# EAGLE design makey_makey-v11 (EAGLE 6.1)

## Sheet 1 of 2
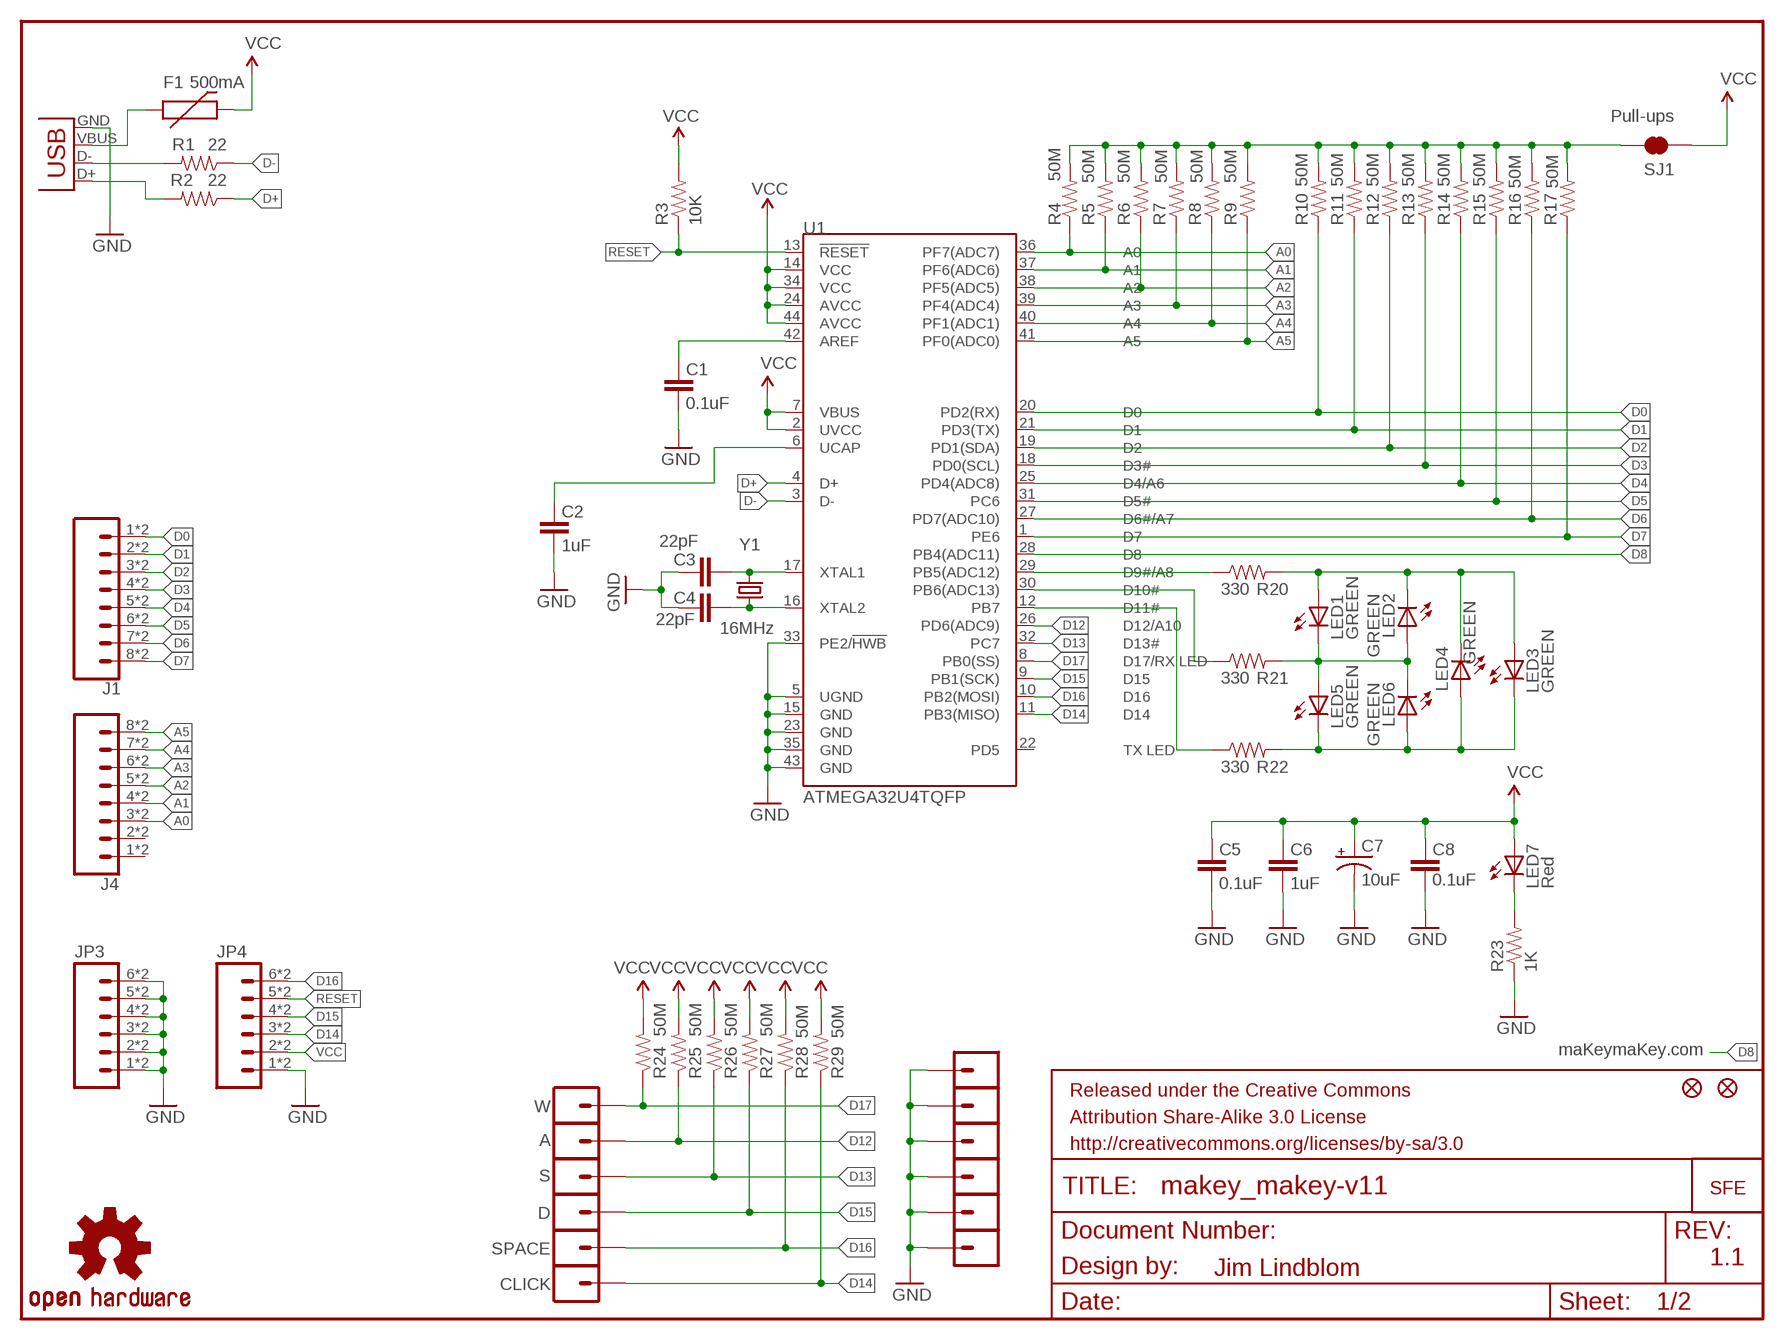
[diagram p0: schematic, sheet 1]

### Parts
A  M01ALLIGATOR-3MM  [1X01_ALLIGATOR_3MM]
C1  0.1uF  CAP0402-CAP  [0402-CAP]
C2  1uF  CAP0402-CAP  [0402-CAP]
C3  22pF  CAP0402-CAP  [0402-CAP]
C4  22pF  CAP0402-CAP  [0402-CAP]
C5  0.1uF  CAP0402-CAP  [0402-CAP]
C6  1uF  CAP0402-CAP  [0402-CAP]
C7  10uF  CAP_POL1206  [EIA3216]
C8  0.1uF  CAP0402-CAP  [0402-CAP]
CLICK  M01ALLIGATOR-3MM  [1X01_ALLIGATOR_3MM]
D  M01ALLIGATOR-3MM  [1X01_ALLIGATOR_3MM]
F1  500mA  PTCSMD  [PTC-1206]
J1  M08SMD-COMBO  [1X08_SMD_COMBINED]
J4  M08SMD-COMBO  [1X08_SMD_COMBINED]
JP1  FIDUCIALUFIDUCIAL  [MICRO-FIDUCIAL]
JP2  FIDUCIALUFIDUCIAL  [MICRO-FIDUCIAL]
JP3  M06SMD-STRAIGHT-COMBO  [1X06_SMD_STRAIGHT_COMBO]
JP4  M06SMD-STRAIGHT-COMBO  [1X06_SMD_STRAIGHT_COMBO]
JP5  M01ALLIGATOR-3MM  [1X01_ALLIGATOR_3MM]
JP6  M01ALLIGATOR-3MM  [1X01_ALLIGATOR_3MM]
JP7  M01ALLIGATOR-3MM  [1X01_ALLIGATOR_3MM]
JP8  M01ALLIGATOR-3MM  [1X01_ALLIGATOR_3MM]
JP9  LOGO-SFENEW  [SFE-NEW-WEBLOGO]
JP10  M01ALLIGATOR-3MM  [1X01_ALLIGATOR_3MM]
JP11  M01ALLIGATOR-3MM  [1X01_ALLIGATOR_3MM]
LED1  GREEN  LED1206-BOTTOM  [LED-1206-BOTTOM]
LED2  GREEN  LED1206-BOTTOM  [LED-1206-BOTTOM]
LED3  GREEN  LED1206-BOTTOM  [LED-1206-BOTTOM]
LED4  GREEN  LED1206-BOTTOM  [LED-1206-BOTTOM]
LED5  GREEN  LED1206-BOTTOM  [LED-1206-BOTTOM]
LED6  GREEN  LED1206-BOTTOM  [LED-1206-BOTTOM]
LED7  Red  LED0603  [LED-0603]
R1  22  RESISTOR0402-RES  [0402-RES]
R2  22  RESISTOR0402-RES  [0402-RES]
R3  10K  RESISTOR0402-RES  [0402-RES]
R4  50M  RESISTOR0402-RES  [0402-RES]
R5  50M  RESISTOR0402-RES  [0402-RES]
R6  50M  RESISTOR0402-RES  [0402-RES]
R7  50M  RESISTOR0402-RES  [0402-RES]
R8  50M  RESISTOR0402-RES  [0402-RES]
R9  50M  RESISTOR0402-RES  [0402-RES]
R10  50M  RESISTOR0402-RES  [0402-RES]
R11  50M  RESISTOR0402-RES  [0402-RES]
R12  50M  RESISTOR0402-RES  [0402-RES]
R13  50M  RESISTOR0402-RES  [0402-RES]
R14  50M  RESISTOR0402-RES  [0402-RES]
R15  50M  RESISTOR0402-RES  [0402-RES]
R16  50M  RESISTOR0402-RES  [0402-RES]
R17  50M  RESISTOR0402-RES  [0402-RES]
R20  330  RESISTOR0402-RES  [0402-RES]
R21  330  RESISTOR0402-RES  [0402-RES]
R22  330  RESISTOR0402-RES  [0402-RES]
R23  1K  RESISTOR0402-RES  [0402-RES]
R24  50M  RESISTOR0402-RES  [0402-RES]
R25  50M  RESISTOR0402-RES  [0402-RES]
R26  50M  RESISTOR0402-RES  [0402-RES]
R27  50M  RESISTOR0402-RES  [0402-RES]
R28  50M  RESISTOR0402-RES  [0402-RES]
R29  50M  RESISTOR0402-RES  [0402-RES]
S  M01ALLIGATOR-3MM  [1X01_ALLIGATOR_3MM]
SJ1  Pull-ups  SOLDERJUMPER-OLDTRACE  [SJ_2S-TRACE]
SPACE  M01ALLIGATOR-3MM  [1X01_ALLIGATOR_3MM]
U1  ATMEGA32U4TQFP  [TQFP44]
U$1  OSHW-LOGOL  [OSHW-LOGO-L]
W  M01ALLIGATOR-3MM  [1X01_ALLIGATOR_3MM]
X1  USBSMD  [USB-MINIB]
Y1  16MHz  CRYSTAL5X3  [CRYSTAL-SMD-5X3]

### Nets
A0: J4.3 J4.3@2 R4.1 U1.36(PF7(ADC7))
A1: J4.4 J4.4@2 R5.1 U1.37(PF6(ADC6))
A2: J4.5 J4.5@2 R6.1 U1.38(PF5(ADC5))
A3: J4.6 J4.6@2 R7.1 U1.39(PF4(ADC4))
A4: J4.7 J4.7@2 R8.1 U1.40(PF1(ADC1))
A5: J4.8 J4.8@2 R9.1 U1.41(PF0(ADC0))
AREF: C1.2 U1.42(AREF)
D0: J1.1 J1.1@2 R10.1 U1.20(PD2(RX))
D1: J1.2 J1.2@2 R11.1 U1.21(PD3(TX))
D2: J1.3 J1.3@2 R12.1 U1.19(PD1(SDA))
D3: J1.4 J1.4@2 R13.1 U1.18(PD0(SCL))
D4: J1.5 J1.5@2 R14.1 U1.25(PD4(ADC8))
D5: J1.6 J1.6@2 R15.1 U1.31(PC6)
D6: J1.7 J1.7@2 R16.1 U1.27(PD7(ADC10))
D7: J1.8 J1.8@2 R17.1 U1.1(PE6)
D8: U1.28(PB4(ADC11))
D9: R20.1 U1.29(PB5(ADC12))
D10: R21.1 U1.30(PB6(ADC13))
D11: R22.1 U1.12(PB7)
D12: A.1@0 A.1@2 R25.1 U1.26(PD6(ADC9))
D13: R26.1 S.1@0 S.1@2 U1.32(PC7)
D14: CLICK.1@0 CLICK.1@2 JP4.3 JP4.3-2 R29.1 U1.11(PB3(MISO))
D15: D.1@0 D.1@2 JP4.4 JP4.4-2 R27.1 U1.9(PB1(SCK))
D16: JP4.6 JP4.6-2 R28.1 SPACE.1@0 SPACE.1@2 U1.10(PB2(MOSI))
D17: R24.1 U1.8(PB0(SS)) W.1@0 W.1@2
D+: R2.1 U1.4(D+)
D-: R1.1 U1.3(D-)
GND [vcc]: C1.1 C2.1 C3.2 C4.2 C5.1 C6.1 C7.C(-) C8.1 JP3.1 JP3.1-2 JP3.2 JP3.2-2 JP3.3 JP3.3-2 JP3.4 JP3.4-2 JP3.5 JP3.5-2 JP3.6 JP3.6-2 JP4.1 JP4.1-2 JP5.1@0 JP5.1@2 JP6.1@0 JP6.1@2 JP7.1@0 JP7.1@2 JP8.1@0 JP8.1@2 JP10.1@0 JP10.1@2 JP11.1@0 JP11.1@2 R23.1 U1.5(UGND) U1.15(GND) U1.23(GND) U1.33(PE2/!HWB) U1.35(GND) U1.43(GND) X1.GND
N$1: C4.1 U1.16(XTAL2) Y1.1
N$2: C3.1 U1.17(XTAL1) Y1.3
N$3: R4.2 R5.2 R6.2 R7.2 R8.2 R9.2 R10.2 R11.2 R12.2 R13.2 R14.2 R15.2 R16.2 R17.2 SJ1.2
N$4: C2.2 U1.6(UCAP)
N$5: F1.1 X1.VBUS
N$6: R1.2 X1.D-
N$7: LED7.C R23.2
N$8: R2.2 X1.D+
N$24: LED1.C LED2.A LED5.A LED6.C R21.2
N$25: LED1.A LED2.C LED3.A LED4.C R20.2
N$26: LED3.C LED4.A LED5.C LED6.A R22.2
RESET: JP4.5 JP4.5-2 R3.1 U1.13(!RESET)
VCC: C5.2 C6.2 C7.A(+) C8.2 F1.2 JP4.2 JP4.2-2 LED7.A R3.2 R24.2 R25.2 R26.2 R27.2 R28.2 R29.2 SJ1.1 U1.2(UVCC) U1.7(VBUS) U1.14(VCC) U1.24(AVCC) U1.34(VCC) U1.44(AVCC)
Unconnected: J4.1 J4.1@2 J4.2 J4.2@2 U1.22(PD5)

### Notes on the sheet
- maKeymaKey.com
- 1.1
- Jim Lindblom

## Sheet 2 of 2
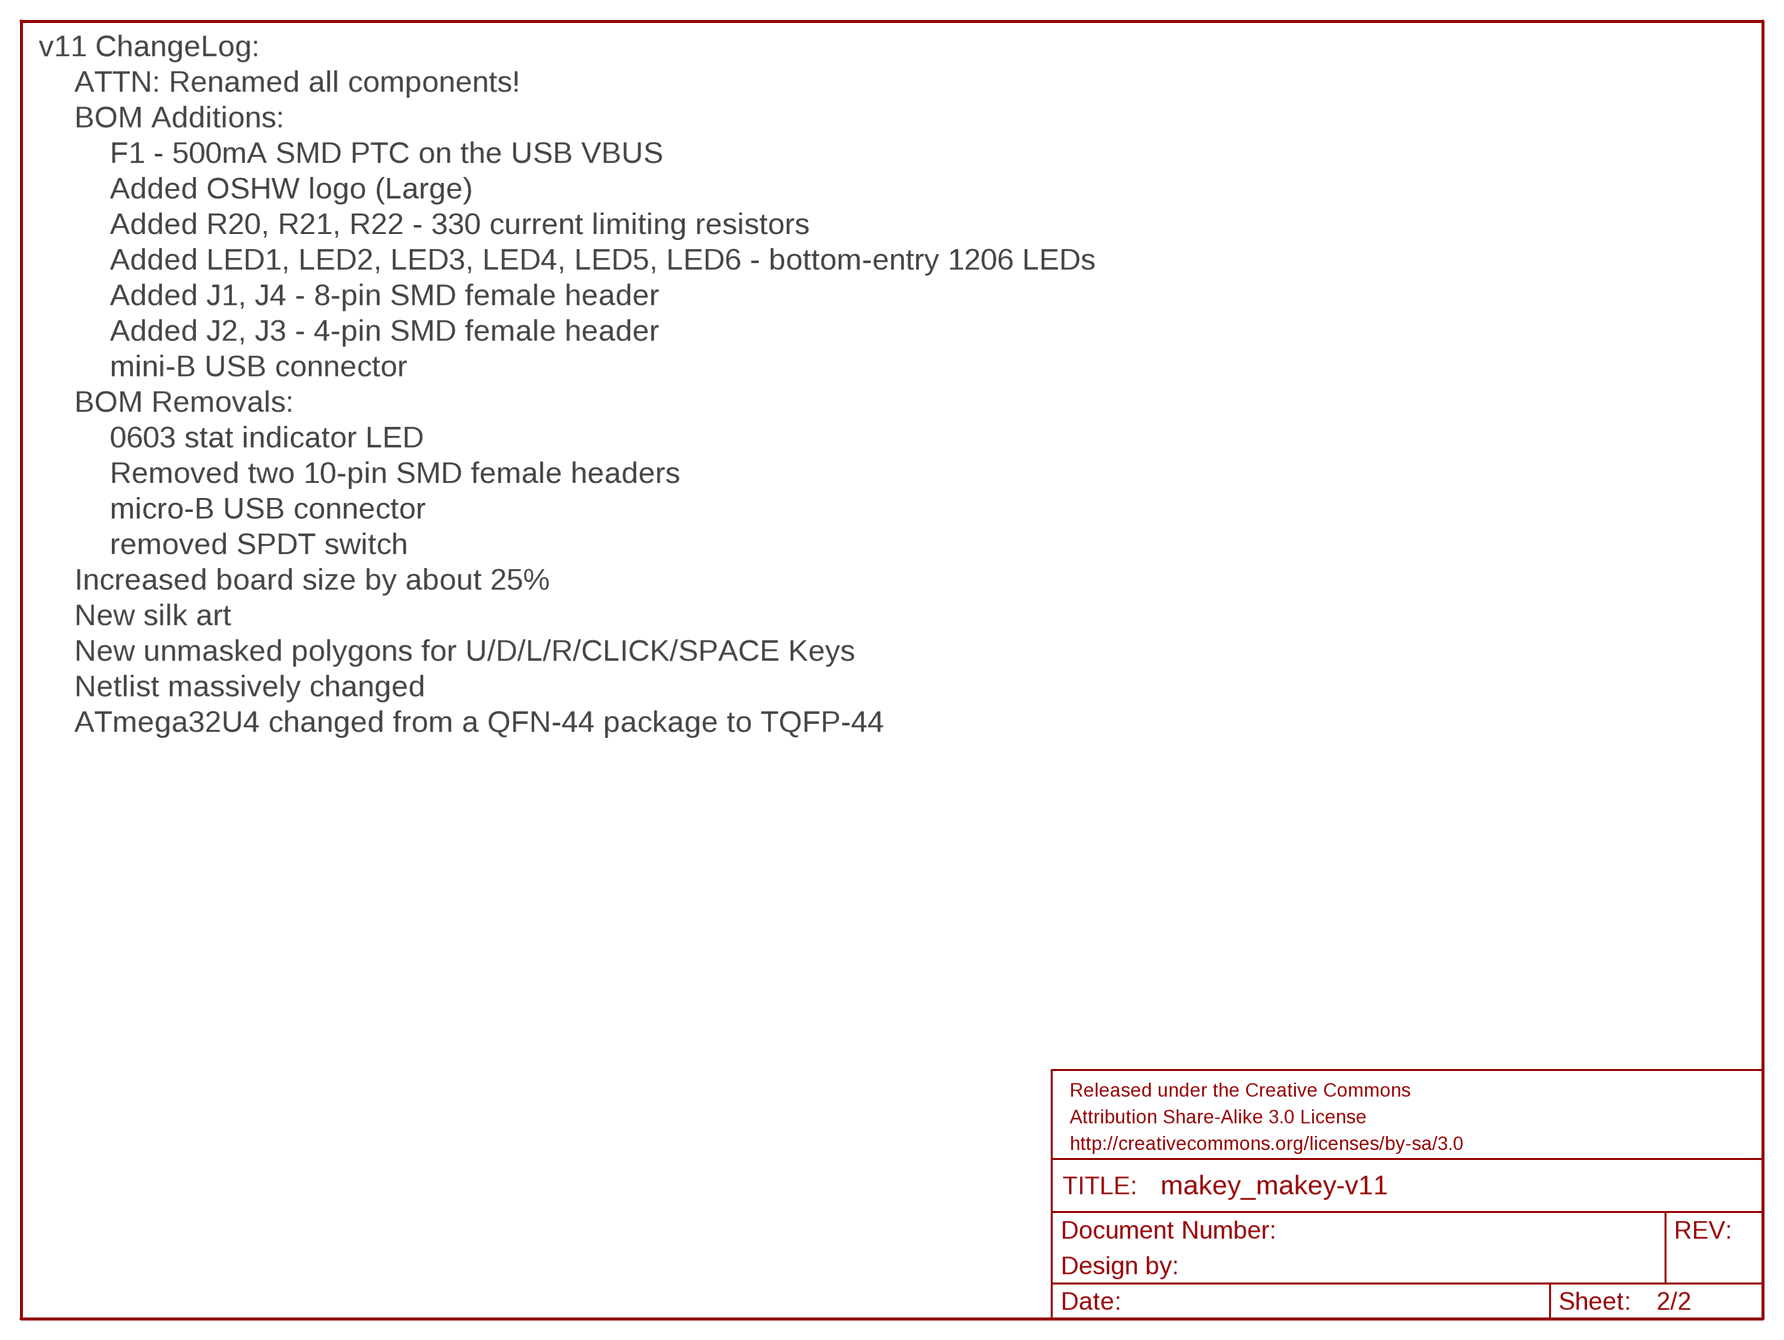
[diagram p1: schematic, sheet 2]

### Notes on the sheet
- v11 ChangeLog:
- ATTN: Renamed all components!
- BOM Additions:
- F1 - 500mA SMD PTC on the USB VBUS
- Added OSHW logo (Large)
- Added R20, R21, R22 - 330 current limiting resistors
- Added LED1, LED2, LED3, LED4, LED5, LED6 - bottom-entry 1206 LEDs
- Added J1, J4 - 8-pin SMD female header
- Added J2, J3 - 4-pin SMD female header
- mini-B USB connector
- BOM Removals:
- 0603 stat indicator LED
- Removed two 10-pin SMD female headers
- micro-B USB connector
- removed SPDT switch
- Increased board size by about 25%
- New silk art
- New unmasked polygons for U/D/L/R/CLICK/SPACE Keys
- Netlist massively changed
- ATmega32U4 changed from a QFN-44 package to TQFP-44

## Library data of the parts
A CLICK D JP5-JP8 JP10 JP11 S SPACE W = SparkFun-Connectors:M01: Header 1 Standard 1-pin 0.1" header. Use with straight break away headers (SKU : PRT-00116), right angle break away headers (PRT-00553), swiss pins (PRT-00743), machine pins (PRT-00117), and female headers (PRT-00115).
C1-C6 C8 = SparkFun:CAP: Capacitor Standard 0603 ceramic capacitor, and 0.1" leaded capacitor.
C7 = SparkFun:CAP_POL: Capacitor Polarized These are standard SMD and PTH capacitors. Normally 10uF, 47uF, and 100uF in electrolytic and tantalum varieties. Always verify the external diameter of the through hole cap, it varies with capacity, voltage, and manufacturer. The EIA devices should be standard.
F1 = SparkFun-PowerIC:PTC: Resettable Fuse PTC Resettable Fuse. Spark Fun Electronics SKU : COM-08357
J1 J4 = SparkFun-Connectors:M08: Header 8 Standard 8-pin 0.1" header. Use with straight break away headers (SKU : PRT-00116), right angle break away headers (PRT-00553), swiss pins (PRT-00743), machine pins (PRT-00117), and female headers (PRT-00115).
JP1 JP2 = SparkFun:FIDUCIAL: Fiducial Alignment Points Various fiducial points for machine vision alignment.
JP3 JP4 = SparkFun-Connectors:M06: Header 6 Standard 6-pin 0.1" header. Use with straight break away headers (SKU : PRT-00116), right angle break away headers (PRT-00553), swiss pins (PRT-00743), machine pins (PRT-00117), and female headers (PRT-00115). Molex polarized connector foot print use with SKU : PRT-08094 with associated crimp pins and housings. NOTES ON THE VARIANTS LOCK and LOCK_LONGPADS... This footprint was designed to help hold the alignment of a through-hole component (i.e. 6-pin header) while soldering it into place. You may notice that each hole has been shifted either up or down by 0.005 of an inch from it's more standard position (which is a perfectly straight line). This slight alteration caused the pins (the squares in the middle) to touch the edges of the holes. Because they are alternating, it causes a "brace" to hold the component in place. 0.005 has proven to be the perfect amount of "off-center" position when using our standard breakaway headers. Although looks a little odd when you look at the bare footprint, once you have a header in there, the alteration is very hard to notice. Also, if you push a header all the way into place, it is covered up entirely on the bottom side. This idea of altering the position of holes to aid alignment will be further integrated into the Sparkfun Library for other footprints. It can help hold any component with 3 or more connection pins.
JP9 = SparkFun:LOGO-SFE: Spark Fun Electronics PCB Logo This is the standard Spark Fun Electronics PCB logo.
LED1-LED6 = SparkFun-LED:LED: LEDs Standard schematic elements and footprints for 5mm, 3mm, 1206, and 0603 sized LEDs. 5mm - Spark Fun Electronics SKU : COM-00529 (and others)
LED7 = SparkFun:LED: LEDs Standard schematic elements and footprints for 5mm, 3mm, 1206, and 0603 sized LEDs. 5mm - Spark Fun Electronics SKU : COM-00529 (and others)
R1-R17 R23-R29 = SparkFun:RESISTOR: Resistor Basic schematic elements and footprints for 0603, 1206, and PTH resistors.
R20-R22 = SparkFun-Passives:RESISTOR: Resistor Basic schematic elements and footprints for 0603, 1206, and PTH resistors.
SJ1 = SparkFun:SOLDERJUMPER-OLD: Solder Jumper Standard SMD solder jumper. Used to automate production. Two varients : Normally Open and Normally Closed are the same, but have different paste layers. NC will have a large amount of paste and should jumper during reflow.
U1 = SparkFun-DigitalIC:ATMEGA32U4: Atmel 44-pin 8-bit Microcontroller with 32KBytes of ISP Flash and USB Controller
U$1 = SparkFun-Aesthetics:OSHW-LOGO: Open Source Hardware Logo This logo indicates the piece of hardware it is found on incorporates a OSHW license and/or adheres to the definition of open source hardware found here: http://freedomdefined.org/OSHW
X1 = SparkFun:USB: USB Connectors USB-B-PTH is fully proven SKU : PRT-00139 USB-miniB is fully proven SKU : PRT-00587 USB-A-PCB is untested. USB-A-H is throughly reviewed, but untested. Spark Fun Electronics SKU : PRT-00437 USB-B-SMT is throughly reviewed, but untested. Needs silkscreen touching up. USB-A-S has not been used/tested USB-MB-H has not been used/tested
Y1 = SparkFun:CRYSTAL: Crystals Various standard crystals. Proven footprints. Spark Fun Electronics SKU : COM-00534

## Net classes
0 default: width 0.203 mm

## Board
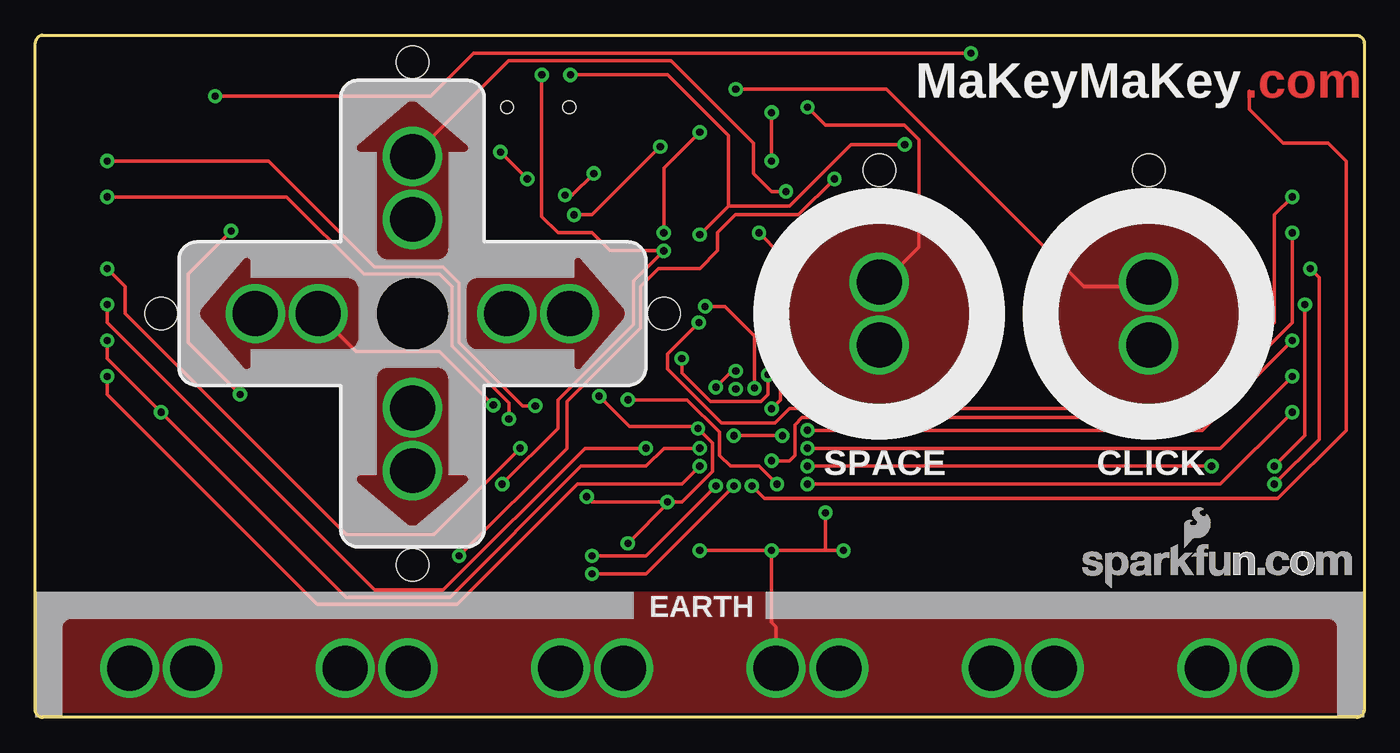
[diagram p2: board, top side]
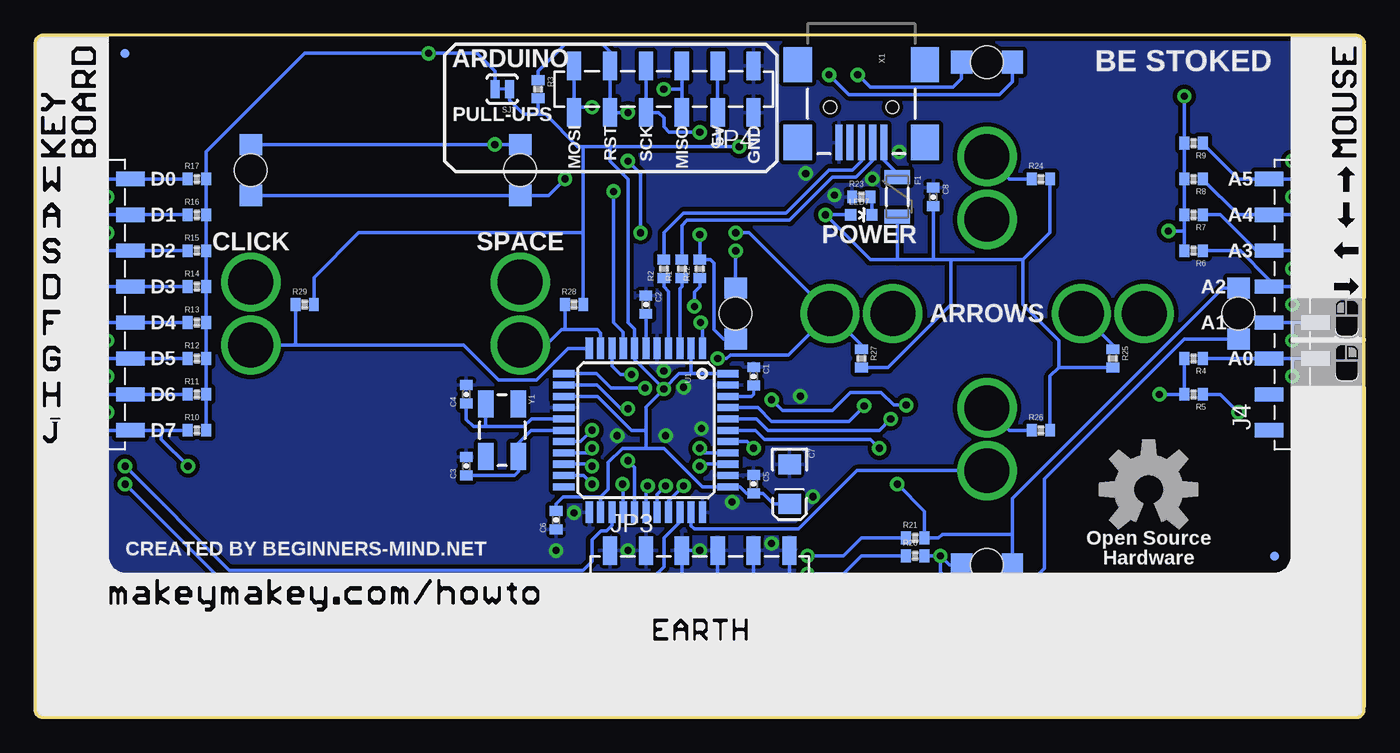
[diagram p3: board, bottom side, seen from below]

Size 93.98 x 48.26 mm. Coordinates in mm from the lower left corner, seen from the top.
Outline: 0,0.54 0,47.72 arc-90 0.54,48.26 93.44,48.26 arc-90 93.98,47.72 93.98,0.54 arc-90 93.44,0 0.54,0 arc-90 0,0.54
Copper layers (1*16): Top 0.035mm / dielectric 1.5mm / Bottom 0.035mm
Design rules: minimum track width 8mil, minimum drill 20mil, track to track 8mil, track to pad 8mil, pad to pad 8mil, via to via 8mil, smd to smd 8mil, copper to edge 8mil, drill to drill 8mil, minimum pad ring 12mil, minimum via ring 10mil, stop-mask expansion 4mil, vias tented up to drill 20mil, thermal gap 10mil

### Footprints (pad centres in the part's own frame; a part is rotated, then mirrored left to right if it is on the bottom)
1X01_ALLIGATOR_3MM = drill 3.175: 1@0 0,2.223; 1@2 0,-2.223
0402-CAP = smd 0.7 x 0.9: 1 -0.65,0; 2 0.65,0
EIA3216 = smd 1.4 x 1.6: A 1.4,0; C -1.4,0
PTC-1206 = smd 1 x 1.8: 1 -1.4,0; 2 1.4,0
1X08_SMD_COMBINED = smd 1 x 2: 1 0,1.65; 1@2 0,-1.65; 2 2.54,-1.65; 2@2 2.54,1.65; 3 5.08,1.65; 3@2 5.08,-1.65; 4 7.62,-1.65; 4@2 7.62,1.65; 5 10.16,1.65; 5@2 10.16,-1.65; 6 12.7,-1.65; 6@2 12.7,1.65; 7 15.24,1.65; 7@2 15.24,-1.65; 8 17.78,-1.65; 8@2 17.78,1.65
MICRO-FIDUCIAL = smd 0.635 x 0.635: 1 0,0
1X06_SMD_STRAIGHT_COMBO = smd 1 x 2: 1 0,-1.65; 1-2 0,1.65; 2 2.54,1.65; 2-2 2.54,-1.65; 3 5.08,-1.65; 3-2 5.08,1.65; 4 7.62,1.65; 4-2 7.62,-1.65; 5 10.16,-1.65; 5-2 10.16,1.65; 6 12.7,1.65; 6-2 12.7,-1.65
LED-1206-BOTTOM = smd 1.5 x 1.6: A -1.8,0; C 1.8,0 | hole 2.3: 0,0
LED-0603 = smd 0.8 x 0.8: A 0,-0.75; C 0,0.75
0402-RES = smd 0.7 x 0.9: 1 -0.65,0; 2 0.65,0
SJ_2S-TRACE = smd 0.635 x 1.27: 1 -0.508,0; 2 0.508,0
TQFP44 = smd 1.5 x 0.5: 1 -5.8,4; 2 -5.8,3.2; 3 -5.8,2.4; 4 -5.8,1.6; 5 -5.8,0.8; 6 -5.8,0; 7 -5.8,-0.8; 8 -5.8,-1.6; 9 -5.8,-2.4; 10 -5.8,-3.2; 11 -5.8,-4; 23 5.8,-4; 24 5.8,-3.2; 25 5.8,-2.4; 26 5.8,-1.6; 27 5.8,-0.8; 28 5.8,0; 29 5.8,0.8; 30 5.8,1.6; 31 5.8,2.4; 32 5.8,3.2; 33 5.8,4 | smd 0.5 x 1.5: 12 -4,-5.8; 13 -3.2,-5.8; 14 -2.4,-5.8; 15 -1.6,-5.8; 16 -0.8,-5.8; 17 0,-5.8; 18 0.8,-5.8; 19 1.6,-5.8; 20 2.4,-5.8; 21 3.2,-5.8; 22 4,-5.8; 34 4,5.8; 35 3.2,5.8; 36 2.4,5.8; 37 1.6,5.8; 38 0.8,5.8; 39 0,5.8; 40 -0.8,5.8; 41 -1.6,5.8; 42 -2.4,5.8; 43 -3.2,5.8; 44 -4,5.8
USB-MINIB = smd 2.5 x 0.5: D+ 2.5,0; D- 2.5,0.8; GND 2.5,-1.6; ID 2.5,-0.8; VBUS 2.5,1.6 | smd 2.5 x 2: MTN1 -3,4.5; MTN2 2.5,4.5; MTN3 -3,-4.5; MTN4 2.5,-4.5 | hole 0.9: 0,2.2; 0,-2.2
CRYSTAL-SMD-5X3 = smd 1.9 x 1.1: 1 -1.85,-1.15; 2 1.85,-1.15; 3 1.85,1.15; 4 -1.85,1.15

### Placement (x,y rotation side)
A  17.78,28.57 270 top
C1  43.18,24.13 270 bottom
C2  50.8,29.21 270 bottom
C3  63.5,17.78 90 bottom
C4  63.5,22.86 90 bottom
C5  43.18,16.51 270 bottom
C6  57.15,13.97 90 bottom
C7  40.64,16.51 270 bottom
C8  30.48,36.83 270 bottom
CLICK  78.74,28.57 180 bottom
D  35.56,28.57 270 top
F1  33.02,36.83 270 bottom
J1  88.9,20.32 90 bottom
J4  5.08,20.32 90 bottom
JP1  87.63,46.99 0 bottom
JP2  6.35,11.43 0 bottom
JP3  53.34,10.16 0 bottom
JP4  43.18,44.45 180 bottom
JP5  85.09,3.49 90 top
JP6  69.85,3.49 90 top
JP7  54.61,3.49 90 top
JP8  39.37,3.49 90 top
JP9  74.04,9.14 0 top
JP10  24.13,3.49 90 top
JP11  8.89,3.49 90 top
LED1  26.67,10.79 0 bottom
LED2  8.89,28.57 270 bottom
LED3  78.74,38.73 90 bottom
LED4  59.69,38.73 270 bottom
LED5  26.67,46.35 0 bottom
LED6  44.45,28.57 90 bottom
LED7  35.56,35.56 270 bottom
R1  48.26,31.75 90 bottom
R2  49.53,31.75 90 bottom
R3  58.42,44.45 270 bottom
R4  12.06,25.4 180 bottom
R5  12.06,22.86 180 bottom
R6  12.06,33.02 180 bottom
R7  12.06,35.56 180 bottom
R8  12.06,38.1 180 bottom
R9  12.06,40.64 180 bottom
R10  82.55,20.32 0 bottom
R11  82.55,22.86 0 bottom
R12  82.55,25.4 0 bottom
R13  82.55,27.94 0 bottom
R14  82.55,30.48 0 bottom
R15  82.55,33.02 0 bottom
R16  82.55,35.56 0 bottom
R17  82.55,38.1 0 bottom
R20  31.75,11.43 0 bottom
R21  31.75,12.7 0 bottom
R22  46.99,31.75 90 bottom
R23  35.56,36.83 0 bottom
R24  22.86,38.1 0 bottom
R25  17.78,25.4 270 bottom
R26  22.86,20.32 0 bottom
R27  35.56,25.4 270 bottom
R28  55.88,29.21 0 bottom
R29  74.93,29.21 0 bottom
S  26.67,19.68 0 top
SJ1  60.96,44.45 180 bottom
SPACE  59.69,28.57 180 bottom
U1  50.8,20.32 270 bottom
U$1  15.24,16.13 0 bottom
W  26.67,37.47 0 top
X1  35.56,43.18 270 bottom
Y1  60.96,20.32 270 bottom

### Tracks (layer width: path | path; a pad name or v marks a point on that pad's centre or on a via)
A0  (via drill 0.51)
  Top 0.254: v46.99,17.78 45.72,16.51 38.35,16.51 29.84,8 19.94,8 5.08,22.86 v5.08,24.13
  Bottom 0.254: R4.1 J4.3 5.08,25.4 | 5.08,25.4 J4.3@2 | U1.36 46.85,17.92 v46.99,17.78 | v5.08,24.13 5.08,25.4
A1  (via drill 0.51)
  Top 0.254: v46.99,19.05 44.45,19.05 43.18,17.78 38.61,17.78 29.34,8.51 21.97,8.51 v8.89,21.59 5.08,25.4 v5.08,26.67
  Bottom 0.254: J4.4 5.08,27.94 | 5.08,27.94 J4.4@2 | U1.37 46.66,18.72 v46.99,19.05 | v5.08,26.67 5.08,27.94 | R5.1 10.16,22.86 v8.89,21.59
A2  (via drill 0.51)
  Top 0.254: v43.18,19.05 38.86,19.05 28.83,9.02 24,9.02 5.08,27.94 v5.08,29.21
  Bottom 0.254: R6.1 8.76,33.02 6.73,30.99 J4.5 5.08,30.48 | 5.08,30.48 J4.5@2 | U1.38 43.65,19.52 v43.18,19.05 | v5.08,29.21 5.08,30.48
A3  (via drill 0.51)
  Top 0.254: v34.29,19.05 28.19,12.95 21.97,12.95 6.35,28.57 6.35,30.48 v5.08,31.75
  Bottom 0.254: R7.1 10.16,35.56 7.62,33.02 J4.6@2 5.08,33.02 | 5.08,33.02 J4.6 | v5.08,31.75 5.08,33.02 | U1.39 43.05,20.32 42.42,19.68 34.92,19.68 v34.29,19.05
A4  (via drill 0.51)
  Top 0.254: v5.08,36.83 17.78,36.83 23.24,31.37 28.57,31.37 29.46,30.48 29.46,26.29 33.49,22.26 v33.49,21.12
  Bottom 0.254: R8.1 11.43,38.1 8.89,35.56 J4.7 5.08,35.56 | 5.08,35.56 J4.7@2 | v5.08,36.83 5.08,35.56 | U1.40 42.96,21.12 42.16,20.32 34.29,20.32 v33.49,21.12
A5  (via drill 0.51)
  Top 0.254: v5.08,39.37 16.51,39.37 24,31.88 28.83,31.88 29.97,30.73 29.97,26.54 34.47,22.05 v35.36,22.05
  Bottom 0.254: 5.08,38.1 J4.8@2 8.89,38.1 11.43,40.64 R9.1 | 5.08,38.1 J4.8 | v5.08,39.37 5.08,38.1 | U1.41 42.88,21.92 41.91,20.95 36.45,20.95 v35.36,22.05
AREF
  Bottom 0.203: C1.2 43.18,22.86
  Bottom 0.254: U1.42 43.32,22.72 43.18,22.86
D0  (via drill 0.51)
  Top 0.254: v54.61,17.78 v83.19,17.78
  Bottom 0.254: R10.1 85.09,20.32 | 85.09,20.32 J1.1@2 J1.1 | U1.20 54.75,17.92 v54.61,17.78 | v83.19,17.78 85.09,19.68 85.09,20.32
D1  (via drill 0.51)
  Top 0.254: v54.61,16.51 83.82,16.51 v88.9,21.59
  Bottom 0.254: R11.1 J1.2 88.9,22.86 | U1.21 55.22,17.12 v54.61,16.51 | J1.2@2 88.9,22.86 | v88.9,21.59 88.9,22.86
D2  (via drill 0.51)
  Top 0.254: v54.61,19.05 83.82,19.05 v88.9,24.13
  Bottom 0.254: R12.1 J1.3@2 88.9,25.4 | U1.19 54.94,18.72 v54.61,19.05 | v88.9,24.13 88.9,25.4 | 88.9,25.4 J1.3
D3  (via drill 0.51)
  Top 0.254: v88.9,26.67 82.55,20.32 v54.61,20.32
  Bottom 0.254: R13.1 J1.4 88.9,27.94 | U1.18 55.41,19.52 v54.61,20.32 | 88.9,27.94 J1.4@2 | v88.9,26.67 88.9,27.94
D4  (via drill 0.51)
  Top 0.254: v89.79,29.21 89.79,19.94 v87.63,17.78
  Bottom 0.254: R14.1 J1.5@2 J1.5 90.55,29.97 v89.79,29.21 | v87.63,17.78 80.26,10.41 55.24,10.41 54.61,11.05 54.61,12.57 53.98,13.21 53.57,13.21 53.2,13.58 U1.25
D5  (via drill 0.51)
  Top 0.254: v87.63,16.51 90.81,19.68 90.81,31.11 v90.17,31.75
  Bottom 0.254: R15.1 J1.6 J1.6@2 90.55,32.13 v90.17,31.75 | v87.63,16.51 81.03,9.91 50.29,9.91 49.53,10.67 49.53,12.7 48.4,13.83 U1.31
D6  (via drill 0.51)
  Top 0.254: v88.9,34.29 88.9,27.94 82.17,21.21 54.23,21.21 53.72,20.7 53.72,18.54 53.34,18.16 v52.07,18.16
  Bottom 0.254: R16.1 J1.7@2 88.9,35.56 | U1.27 51.6,17.69 v52.07,18.16 | v88.9,34.29 88.9,35.56 | 88.9,35.56 J1.7
D7  (via drill 0.51)
  Top 0.254: v88.9,36.83 87.63,35.56 87.63,27.94 81.53,21.84 53.34,21.84 52.32,20.83 48.51,20.83 44.7,24.64 44.7,25.72 v46.93,27.94
  Bottom 0.254: R17.1 J1.8 88.9,38.1 | v88.9,36.83 88.9,38.1 | J1.8@2 88.9,38.1 | U1.1 46.8,27.81 v46.93,27.94
D8  (via drill 0.51)
  Top 0.254: v50.67,16.38 51.56,15.49 87.88,15.49 92.71,20.32 92.71,39.37 91.44,40.64 88.27,40.64 85.85,43.05 85.85,44.32
  Bottom 0.254: U1.28 50.8,16.26 v50.67,16.38
D9  (via drill 0.51)
  Top 0.254: v49.4,16.38 43.18,10.16 v39.37,10.16
  Bottom 0.254: U1.29 50,15.79 v49.4,16.38 | v39.37,10.16 36.83,10.16 35.56,11.43 R20.1
D10  (via drill 0.51)
  Top 0.254: v48.13,16.38 43.18,11.43 v39.37,11.43
  Bottom 0.254: U1.30 49.2,15.32 v48.13,16.38 | v39.37,11.43 36.83,11.43 35.56,12.7 R21.1
D11  (via drill 0.51)
  Top 0.254: v50.86,23.3 50.86,26.99 48.77,29.08 v47.37,29.08
  Bottom 0.254: U1.12 54.29,24.32 53.28,23.3 v50.86,23.3 | v47.37,29.08 47.37,30.1 46.99,30.48 R22.1
D12  (via drill 0.51)
  Top 0.254: v52.45,16.51 51.18,17.78 49.15,17.78 48.39,18.54 48.39,20.19 46.1,22.48 v41.91,22.48 | v32.38,22.1 28.57,25.91 22.67,25.91 A.1@0
  Bottom 0.254: U1.26 52.4,16.46 v52.45,16.51 | v32.38,22.1 33.27,22.1 34.16,22.99 36.32,22.99 37.59,21.72 41.15,21.72 v41.91,22.48 | R25.1 17.78,26.35 A.1@0
  pour Top (no thermals): 15.24,26.04 22.05,26.04 arc90 22.86,26.85 22.86,30.3 arc90 22.05,31.11 15.24,31.11 15.24,32.25 arc139 14.74,32.44 11.78,28.99 arc81 11.78,28.16 14.74,24.71 arc139 15.24,24.9
D13
  Bottom 0.254: U1.32 47.6,13.56 47.37,13.34 40.01,13.34 35.88,17.46 S.1@2 | R26.1 25.08,20.32 S.1@0
  pour Top (no thermals): 29.21,17.14 29.21,23.95 arc90 28.4,24.77 24.94,24.77 arc90 24.13,23.95 24.13,17.14 22.99,17.14 arc139 22.81,16.65 26.26,13.69 arc81 27.08,13.69 30.53,16.65 arc139 30.35,17.14
D14  (via drill 0.51)
  Top 0.254: v49.53,44.45 60.2,44.45 74.17,30.48 78.74,30.48
  Bottom 0.254: U1.11 56.3,26.12 58.55,23.88 61.21,23.88 63.69,26.35 75.56,26.35 | R29.1 75.58,26.37 75.56,26.35 | JP4.3 48.26,44.45 | 48.26,44.45 JP4.3-2 | v49.53,44.45 48.26,44.45 | CLICK.1@0 75.56,26.35
  pour Top (no thermals): 72.39,28.57 arc-90 78.74,34.92 arc-90 85.09,28.57 arc-90 78.74,22.23 arc-90
D15  (via drill 0.51)
  Top 0.254: v51.82,24.26 51.82,22.86 51.31,22.35 47.75,22.35 45.72,24.38 v45.72,25.4 | v44.45,34.29 44.45,38.86 v46.99,41.4
  Bottom 0.254: U1.9 53.2,24.88 52.58,24.26 v51.82,24.26 | JP4.4-2 JP4.4 | JP4.4 50.17,42.8 | JP4.4 49.91,42.8 49.53,42.42 49.53,41.78 49.15,41.4 v46.99,41.4 | v44.45,34.29 43.5,34.29 D.1@0 | D.1@0 40.7,25.65 44.83,25.65 45.09,25.4 v45.72,25.4 | R27.1 35.56,26.35 D.1@0
  pour Top (no thermals): 38.1,31.11 31.29,31.11 arc90 30.48,30.3 30.48,26.85 arc90 31.29,26.04 38.1,26.04 38.1,24.9 arc139 38.6,24.71 41.56,28.16 arc81 41.56,28.99 38.6,32.44 arc139 38.1,32.25
D16  (via drill 0.51)
  Top 0.254: v54.61,43.18 55.88,41.91 61.47,41.91 62.48,40.89 62.48,33.27 59.69,30.48
  Bottom 0.254: 56.52,27.43 56.77,27.43 57.85,26.35 SPACE.1@0 | 56.52,27.43 54.23,27.43 54,27.2 U1.10 | R28.1 56.53,27.45 56.52,27.43 | v54.61,43.18 55.88,43.18 JP4.6 JP4.6-2
  pour Top (no thermals): 53.34,28.57 arc-90 59.69,34.92 arc-90 66.04,28.57 arc-90 59.69,22.23 arc-90
D17  (via drill 0.51)
  Top 0.254: W.1@0 33.47,46.48 44.96,46.48 50.8,40.64 50.8,38.48 52.07,37.21 v53.09,37.21
  Bottom 0.254: U1.8 52.4,27.25 53.09,27.94 v53.09,37.21 | R24.1 25.08,38.1 W.1@0
  pour Top (no thermals): 24.13,40.01 24.13,33.2 arc90 24.94,32.38 28.4,32.38 arc90 29.21,33.2 29.21,40.01 30.35,40.01 arc139 30.53,40.5 27.08,43.46 arc81 26.26,43.46 22.81,40.5 arc139 22.99,40.01
D+
  Bottom 0.254: U1.4 49.2,30.15 49.53,30.48 R2.1
D-
  Bottom 0.254: U1.3 48.4,30.34 48.26,30.48 R1.1
GND  (via drill 0.51)
  Top 0.254: v44.7,15.24 45.72,15.24 47.88,17.4 47.88,19.43 v46.86,20.45 46.74,20.57 42.04,20.57 v39.88,22.73 | v49.53,24.51 49.28,24.51 v48.13,23.37 | v37.47,36.96 37.97,36.96 v39.5,38.48 | v41.91,12.32 44.83,15.24 v44.7,15.24 | v57.15,11.81 55.88,11.81 | 55.88,11.81 v52.07,11.81 | v55.88,14.48 55.88,11.81 | v46.99,11.81 v52.07,11.81 | JP7.1@0 52.39,6.41 52.07,6.73 v52.07,11.81 | v44.7,15.24 39.37,15.24 v38.99,15.62 | v34.8,38.1 v32.89,40.01 | v52.83,19.94 v49.4,19.94
  Bottom 0.254: JP3.3-2 v46.99,11.81 | JP3.2-2 52.96,8.51 53.34,8.89 | JP3.1 JP3.2-2 | 41.02,8.51 40.64,8.89 | 40.64,8.89 40.64,11.43 | JP3.5 43.18,11.43 | JP3.4-2 45.72,11.43 | JP3.3 48.26,11.43 | JP3.2-2 JP3.6-2 40.64,8.89
  pour Top (no thermals): 1.91,0 1.91,6.35 arc-90 2.54,6.99 42.29,6.99 42.29,8.89 51.69,8.89 51.69,6.99 91.44,6.99 arc-90 92.08,6.35 92.08,0
  pour Bottom (isolate 0.305): 5.08,48.26 5.08,10.16 88.9,10.16 88.9,48.26
N$1
  Bottom 0.254: U1.16 58.89,21.12 59.44,20.57 62.1,20.57 | 62.1,20.57 62.99,20.57 63.5,21.08 C4.1 | Y1.1 62.15,22.21 62.15,20.62 62.1,20.57
N$2
  Bottom 0.254: U1.17 58.93,20.32 59.81,19.44 Y1.3 59.81,17.41 60.09,17.13 C3.1
N$3  (via drill 0.51)
  Top 0.254: v66.17,46.99 30.99,46.99 27.95,43.96 v12.71,43.96 | v13.84,34.42 10.79,31.37 10.79,26.54 v14.48,22.86
  Bottom 0.254: R10.2 R11.2 R12.2 R13.2 R14.2 R15.2 R16.2 R17.2 81.9,40.02 74.93,46.99 v66.17,46.99 62.74,46.99 61.47,45.72 SJ1.2 | v12.71,43.96 R9.2 R8.2 R7.2 12.71,34.42 | R6.2 12.71,34.42 | v13.84,34.42 12.71,34.42 | v14.48,22.86 R5.2 R4.2
N$4
  Bottom 0.254: U1.6 C2.2
N$5
  Bottom 0.254: X1.VBUS 33.96,39.42 33.02,38.48 F1.1
N$6
  Bottom 0.254: X1.D- 34.76,39.41 35.94,38.23 37.59,38.23 40.64,35.18 47.88,35.18 48.26,34.8 R1.2
N$7
  Bottom 0.254: LED7.C 34.81,36.73 R23.2
N$8
  Bottom 0.254: R2.2 49.53,34.29 48.13,35.69 40.89,35.69 37.85,38.73 36.2,38.73 35.56,39.37 X1.D+
N$9
  pour Top: 45.24,7.99 45.24,8.05 45.55,8.37 45.87,8.05 45.87,7.99
N$10
  pour Top: 46.64,7.91 46.64,8.41 47.13,8.41 47.28,8.26 47.28,7.92 47.13,7.77 46.64,7.77 46.64,7.91 46.64,7.91
N$24  (via drill 0.51)
  Top 0.254: v33.02,16.51 36.96,20.45 36.96,22.48 42.29,27.81 42.29,30.86 v44.45,33.02 40.64,33.02 39.37,34.29 36.96,34.29 35.81,35.43 v35.81,45.47
  Bottom 0.254: 24.87,12.95 29.84,12.95 30.1,12.7 R21.2 31.1,14.59 v33.02,16.51 | LED2.A 10.01,30.38 24.87,15.52 24.87,12.95 | v44.45,33.02 LED6.C | v35.81,45.47 34.92,44.58 29.08,44.58 28.47,45.19 LED5.A | LED1.C 24.87,12.95
N$25  (via drill 0.51)
  Top 0.254: v56.52,38.1 53.98,35.56 49.53,35.56 48.26,34.29 48.26,33.02 46.99,31.75 44.07,31.75 42.8,30.48 42.8,27.56 37.59,22.35 37.59,19.05 v29.97,11.43
  Bottom 0.254: LED2.C 12.72,26.77 22.61,16.89 22.61,10.54 24.26,8.89 28.57,8.89 29.97,10.29 v29.97,11.43 | LED3.A 59.71,36.94 59.69,36.96 LED4.C 57.68,36.94 v56.52,38.1 | R20.2 v29.97,11.43 | LED1.A 29.34,10.79 v29.97,11.43
N$26  (via drill 0.51)
  Top 0.254: v61.49,40.53 57.68,40.53 53.34,36.2 49.02,36.2 | v37.85,45.47 44.7,45.47 49.02,41.15 49.02,36.2 | 49.02,36.2 v46.99,34.16
  Bottom 0.254: LED4.A v61.49,40.53 LED3.C | v46.99,34.16 R22.2 46.24,32.4 45.97,32.13 45.97,27.43 45.32,26.77 LED6.A | v37.85,45.47 36.45,44.07 25.78,44.07 24.87,44.98 LED5.C
RESET  (via drill 0.51)
  Top 0.254: v51.18,34.29 52.7,32.77 52.7,22.48 v52.07,21.84 | v52.07,39.37 v52.07,42.8
  Bottom 0.254: U1.13 54.25,23.52 52.58,21.84 v52.07,21.84 | v52.07,42.8 JP4.5-2 JP4.5 53.34,47.12 53.85,47.62 56.52,47.62 58.42,45.72 R3.1 | v51.18,34.29 51.18,38.48 v52.07,39.37
VCC  (via drill 0.51)
  Top 0.254: v38.1,35.56 39.37,35.56 v44.2,40.39
  Bottom 0.254: 50.8,19.05 50.8,20.32 | v49.53,23.24 51.6,25.31 U1.7 | 55.24,40.39 53.34,40.39 | U1.44 47.62,24.32 | 47.62,24.32 48.45,24.32 v49.53,23.24 | U1.2 47.6,24.34 47.62,24.32 | 24.13,32.38 22.21,34.3 R24.2 | 24.13,32.38 24.13,29.21 21.59,26.67 21.59,24.77 | C7.A 41.78,15.11 42.53,15.86 C5.2 43.67,15.86 44.13,16.32 U1.34 46.8,16.32 49.53,19.05 50.8,19.05 | 55.24,34.29 55.24,40.39 | 55.24,34.29 71.12,34.29 74.28,31.13 R29.2 | U1.14 54.22,22.72 51.82,20.32 50.8,20.32 | 50.8,19.05 52.45,19.05 53.47,18.03 53.47,16.13 54,15.6 | U1.24 54,15.6 | U1.7 51.6,26.71 | U1.7 51.6,27.47 52.07,27.94 52.07,38.1 53.34,39.37 53.34,40.39 | 53.34,40.39 45.72,40.39 | 45.72,40.39 v44.2,40.39 | 24.13,32.38 29.21,32.38 | 29.21,32.38 30.48,32.38 | 30.48,32.38 33.02,32.38 | R25.2 21.57,24.75 21.59,24.77 | R26.2 22.21,24.14 21.59,24.77 | 55.24,34.29 55.24,29.23 R28.2 | R27.2 33.67,24.75 29.21,29.21 29.21,32.38 | F1.2 33.02,32.38 | 33.02,32.38 34.92,32.38 v38.1,35.56 LED7.A | C8.2 30.48,32.38 | 55.24,40.39 55.63,40.39 57.91,42.67 58.42,42.67 | JP4.2 46.1,42.8 | JP4.2 JP4.2-2 | JP4.2 45.72,40.39 | 58.42,42.67 59.44,42.67 60.45,43.69 SJ1.1 | R3.2 58.42,42.67 | C6.2 57.15,15.11 56.64,15.62 54,15.62 54,15.6 | 50.8,20.32 50.8,21.97 v49.53,23.24

### Text on the board
Top: .com
tPlace: MaKeyMaKey | SPACE | CLICK | EARTH
bPlace: BE STOKED | ARDUINO | PULL-UPS | GND | 5V | MISO | SCK | RST | MOSI | A5 | D0 | A4 | D1 | POWER | SPACE | CLICK | A3 | D2 | A2 | D3 | ARROWS | A1 | D4 | A0 | D5 | D6 | D7 | Open Source | Hardware | CREATED BY BEGINNERS-MIND.NET
tStop: .com
tRestrict: EARTH
200bmp: BOARD | KEY | W | A | S | D | F | G | H | J | makeymakey.com/howto | EARTH